# EAGLE schematic eagel_107 (EAGLE 7.7.0)
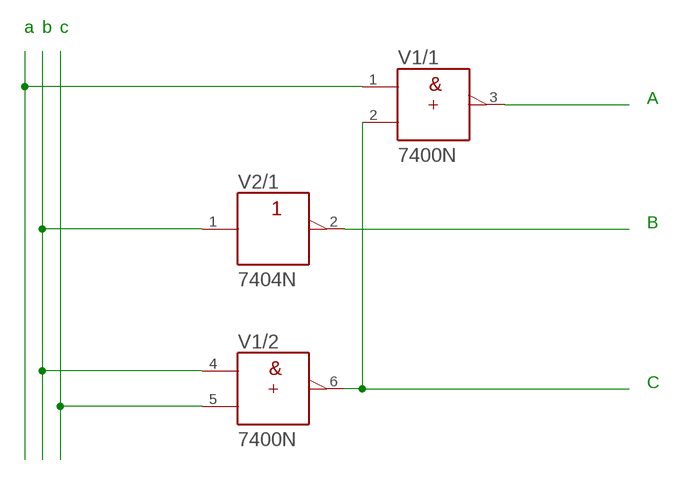
[diagram p0: schematic, sheet 1]

## Parts
V1  7400N  [DIL14]
V2  7404N  [DIL14]

## Nets
N$1: V1.1(/1:A) V1.4(/2:A) V1.5(/2:B) V2.1(/1:A)
N$2: V1.2(/1:B) V1.6(/2:Y)
N$3: V2.2(/1:Y)
N$4: V1.3(/1:Y)
Unconnected: V1.8(/3:Y) V1.9(/3:A) V1.10(/3:B) V1.11(/4:Y) V1.12(/4:A) V1.13(/4:B) V2.3(/2:A) V2.4(/2:Y) V2.5(/3:A) V2.6(/3:Y) V2.8(/4:Y) V2.9(/4:A) V2.10(/5:Y) V2.11(/5:A) V2.12(/6:Y) V2.13(/6:A)

## Notes on the sheet
- a | b | c
- A
- B
- C

## Power pins joined to a net without a drawn wire
+UB: V1.14(/+UB:+UB) V2.14(/+UB:+UB)
-UB: V1.7(/-UB:-UB) V2.7(/-UB:-UB)

## Library data of the parts
V1 = 74ttl-din:74*00: Quad 2-input NAND gate
V2 = 74ttl-din:74*04: Hex INVERTER